# Altium schematic sheet LoadCellAmplifier.SchDoc
size A3; SheetNumber: 1; SheetTotal: 1
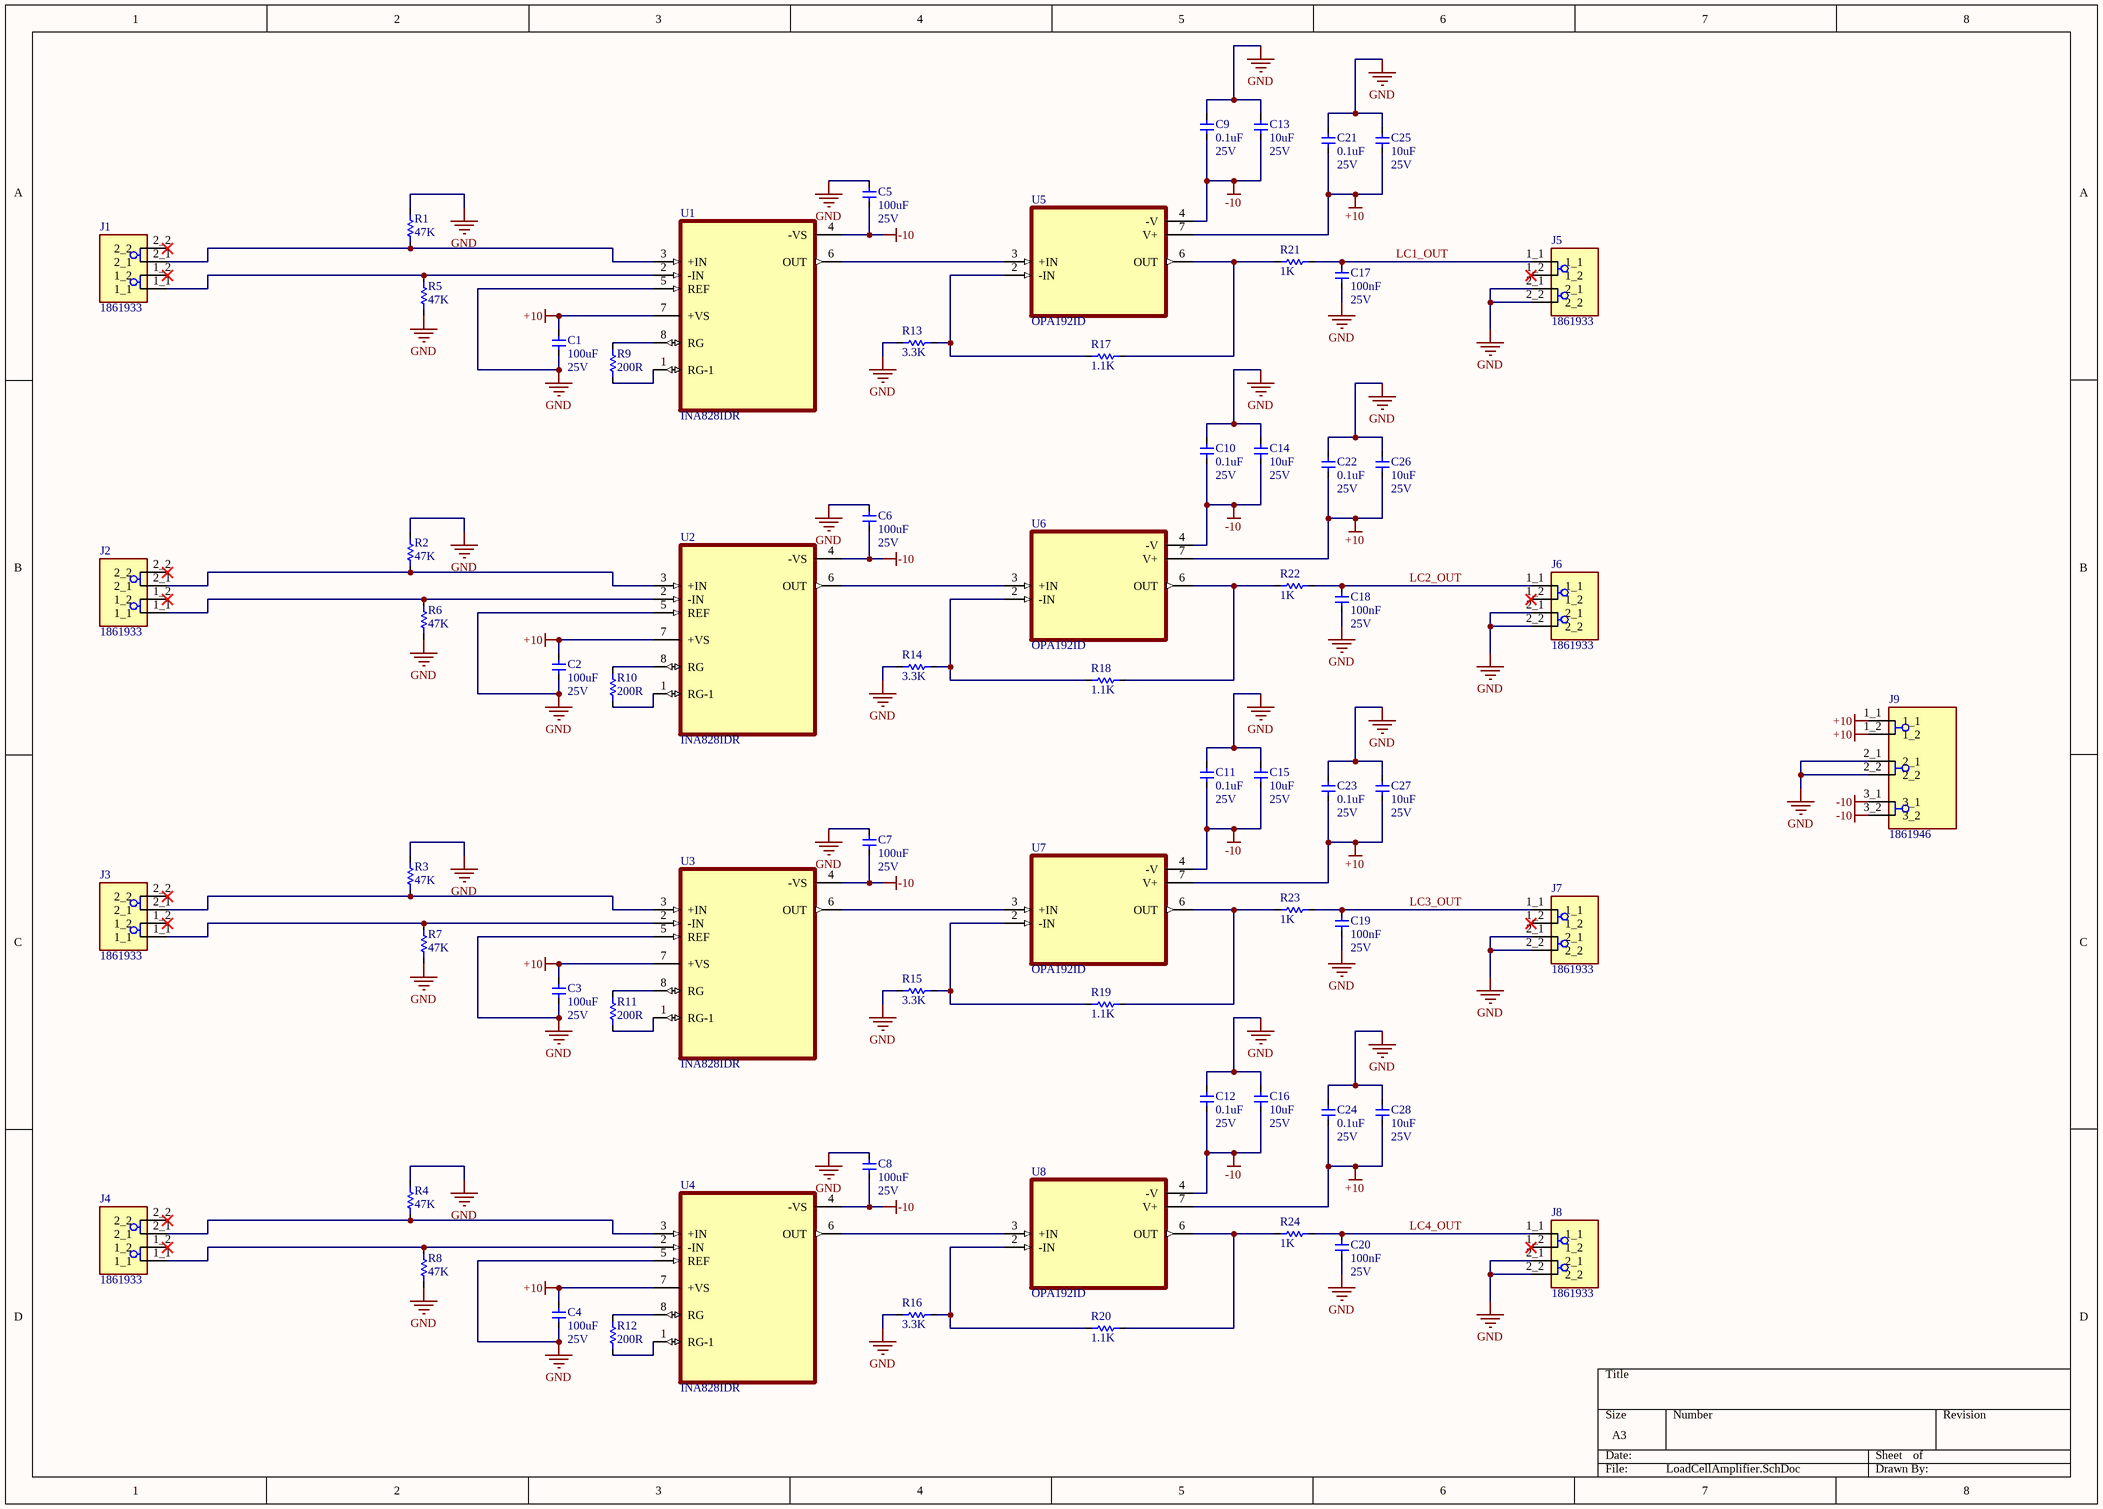
[diagram p0: LoadCellAmplifier.SchDoc]

## Parts
C1  Capacitance: 100uF  Voltage - Rated: 25V  [0603]  (hidden comment: CGA3E2X7R1E104K080AA)
C2  Capacitance: 100uF  Voltage - Rated: 25V  [0603]  (hidden comment: CGA3E2X7R1E104K080AA)
C3  Capacitance: 100uF  Voltage - Rated: 25V  [0603]  (hidden comment: CGA3E2X7R1E104K080AA)
C4  Capacitance: 100uF  Voltage - Rated: 25V  [0603]  (hidden comment: CGA3E2X7R1E104K080AA)
C5  Capacitance: 100uF  Voltage - Rated: 25V  [0603]  (hidden comment: CGA3E2X7R1E104K080AA)
C6  Capacitance: 100uF  Voltage - Rated: 25V  [0603]  (hidden comment: CGA3E2X7R1E104K080AA)
C7  Capacitance: 100uF  Voltage - Rated: 25V  [0603]  (hidden comment: CGA3E2X7R1E104K080AA)
C8  Capacitance: 100uF  Voltage - Rated: 25V  [0603]  (hidden comment: CGA3E2X7R1E104K080AA)
C9  Capacitance: 0.1uF  Voltage - Rated: 25V  [0603]  (hidden comment: CGA3E2X7R1E104K080AA)
C10  Capacitance: 0.1uF  Voltage - Rated: 25V  [0603]  (hidden comment: CGA3E2X7R1E104K080AA)
C11  Capacitance: 0.1uF  Voltage - Rated: 25V  [0603]  (hidden comment: CGA3E2X7R1E104K080AA)
C12  Capacitance: 0.1uF  Voltage - Rated: 25V  [0603]  (hidden comment: CGA3E2X7R1E104K080AA)
C13  Capacitance: 10uF  Voltage - Rated: 25V  [0603]  (hidden comment: CGA3E2X7R1E104K080AA)
C14  Capacitance: 10uF  Voltage - Rated: 25V  [0603]  (hidden comment: CGA3E2X7R1E104K080AA)
C15  Capacitance: 10uF  Voltage - Rated: 25V  [0603]  (hidden comment: CGA3E2X7R1E104K080AA)
C16  Capacitance: 10uF  Voltage - Rated: 25V  [0603]  (hidden comment: CGA3E2X7R1E104K080AA)
C17  Capacitance: 100nF  Voltage - Rated: 25V  [0603]  (hidden comment: CGA3E2X7R1E104K080AA)
C18  Capacitance: 100nF  Voltage - Rated: 25V  [0603]  (hidden comment: CGA3E2X7R1E104K080AA)
C19  Capacitance: 100nF  Voltage - Rated: 25V  [0603]  (hidden comment: CGA3E2X7R1E104K080AA)
C20  Capacitance: 100nF  Voltage - Rated: 25V  [0603]  (hidden comment: CGA3E2X7R1E104K080AA)
C21  Capacitance: 0.1uF  Voltage - Rated: 25V  [0603]  (hidden comment: CGA3E2X7R1E104K080AA)
C22  Capacitance: 0.1uF  Voltage - Rated: 25V  [0603]  (hidden comment: CGA3E2X7R1E104K080AA)
C23  Capacitance: 0.1uF  Voltage - Rated: 25V  [0603]  (hidden comment: CGA3E2X7R1E104K080AA)
C24  Capacitance: 0.1uF  Voltage - Rated: 25V  [0603]  (hidden comment: CGA3E2X7R1E104K080AA)
C25  Capacitance: 10uF  Voltage - Rated: 25V  [0603]  (hidden comment: CGA3E2X7R1E104K080AA)
C26  Capacitance: 10uF  Voltage - Rated: 25V  [0603]  (hidden comment: CGA3E2X7R1E104K080AA)
C27  Capacitance: 10uF  Voltage - Rated: 25V  [0603]  (hidden comment: CGA3E2X7R1E104K080AA)
C28  Capacitance: 10uF  Voltage - Rated: 25V  [0603]  (hidden comment: CGA3E2X7R1E104K080AA)
J1  1861933  [PHOENIX_1861933]
J2  1861933  [PHOENIX_1861933]
J3  1861933  [PHOENIX_1861933]
J4  1861933  [PHOENIX_1861933]
J5  1861933  [PHOENIX_1861933]
J6  1861933  [PHOENIX_1861933]
J7  1861933  [PHOENIX_1861933]
J8  1861933  [PHOENIX_1861933]
J9  1861946  [PHOENIX_1861946]
R1  Resistance: 47K  [0603]  (hidden comment: ERJ-3GEYJ103V)
R2  Resistance: 47K  [0603]  (hidden comment: ERJ-3GEYJ103V)
R3  Resistance: 47K  [0603]  (hidden comment: ERJ-3GEYJ103V)
R4  Resistance: 47K  [0603]  (hidden comment: ERJ-3GEYJ103V)
R5  Resistance: 47K  [0603]  (hidden comment: ERJ-3GEYJ103V)
R6  Resistance: 47K  [0603]  (hidden comment: ERJ-3GEYJ103V)
R7  Resistance: 47K  [0603]  (hidden comment: ERJ-3GEYJ103V)
R8  Resistance: 47K  [0603]  (hidden comment: ERJ-3GEYJ103V)
R9  Resistance: 200R  [0603]  (hidden comment: ERJ-3GEYJ103V)
R10  Resistance: 200R  [0603]  (hidden comment: ERJ-3GEYJ103V)
R11  Resistance: 200R  [0603]  (hidden comment: ERJ-3GEYJ103V)
R12  Resistance: 200R  [0603]  (hidden comment: ERJ-3GEYJ103V)
R13  Resistance: 3.3K  [0603]  (hidden comment: ERJ-3GEYJ103V)
R14  Resistance: 3.3K  [0603]  (hidden comment: ERJ-3GEYJ103V)
R15  Resistance: 3.3K  [0603]  (hidden comment: ERJ-3GEYJ103V)
R16  Resistance: 3.3K  [0603]  (hidden comment: ERJ-3GEYJ103V)
R17  Resistance: 1.1K  [0603]  (hidden comment: ERJ-3GEYJ103V)
R18  Resistance: 1.1K  [0603]  (hidden comment: ERJ-3GEYJ103V)
R19  Resistance: 1.1K  [0603]  (hidden comment: ERJ-3GEYJ103V)
R20  Resistance: 1.1K  [0603]  (hidden comment: ERJ-3GEYJ103V)
R21  Resistance: 1K  [0603]  (hidden comment: ERJ-3GEYJ103V)
R22  Resistance: 1K  [0603]  (hidden comment: ERJ-3GEYJ103V)
R23  Resistance: 1K  [0603]  (hidden comment: ERJ-3GEYJ103V)
R24  Resistance: 1K  [0603]  (hidden comment: ERJ-3GEYJ103V)
U1  INA828IDR  [SOIC127P599X175-8N]
U2  INA828IDR  [SOIC127P599X175-8N]
U3  INA828IDR  [SOIC127P599X175-8N]
U4  INA828IDR  [SOIC127P599X175-8N]
U5  OPA192ID  [SOIC127P599X175-8N]
U6  OPA192ID  [SOIC127P599X175-8N]
U7  OPA192ID  [SOIC127P599X175-8N]
U8  OPA192ID  [SOIC127P599X175-8N]

## Nets
+10: C1.1 C2.1 C3.1 C4.1 C21.2 C22.2 C23.2 C24.2 C25.2 C26.2 C27.2 C28.2 J9.1_1 J9.1_2 U1.7(+VS) U2.7(+VS) U3.7(+VS) U4.7(+VS) U5.7(V+) U6.7(V+) U7.7(V+) U8.7(V+)
-10: C5.2 C6.2 C7.2 C8.2 C9.2 C10.2 C11.2 C12.2 C13.2 C14.2 C15.2 C16.2 J9.3_1 J9.3_2 U1.4(-VS) U2.4(-VS) U3.4(-VS) U4.4(-VS) U5.4(-V) U6.4(-V) U7.4(-V) U8.4(-V)
GND: C1.2 C2.2 C3.2 C4.2 C5.1 C6.1 C7.1 C8.1 C9.1 C10.1 C11.1 C12.1 C13.1 C14.1 C15.1 C16.1 C17.2 C18.2 C19.2 C20.2 C21.1 C22.1 C23.1 C24.1 C25.1 C26.1 C27.1 C28.1 J5.2_1 J5.2_2 J6.2_1 J6.2_2 J7.2_1 J7.2_2 J8.2_1 J8.2_2 J9.2_1 J9.2_2 R1.1 R2.1 R3.1 R4.1 R5.2 R6.2 R7.2 R8.2 R13.1 R14.1 R15.1 R16.1 U1.5(REF) U2.5(REF) U3.5(REF) U4.5(REF)
LC1_OUT: C17.1 J5.1_1 R21.1
LC2_OUT: C18.1 J6.1_1 R22.1
LC3_OUT: C19.1 J7.1_1 R23.1
LC4_OUT: C20.1 J8.1_1 R24.1
NetJ1_1_1: J1.1_1 R5.1 U1.2(-IN)
NetJ1_2_1: J1.2_1 R1.2 U1.3(+IN)
NetJ2_1_1: J2.1_1 R6.1 U2.2(-IN)
NetJ2_2_1: J2.2_1 R2.2 U2.3(+IN)
NetJ3_1_1: J3.1_1 R7.1 U3.2(-IN)
NetJ3_2_1: J3.2_1 R3.2 U3.3(+IN)
NetJ4_1_1: J4.1_1 R8.1 U4.2(-IN)
NetJ4_2_1: J4.2_1 R4.2 U4.3(+IN)
NetR9_1: R9.1 U1.1(RG-1)
NetR9_2: R9.2 U1.8(RG)
NetR10_1: R10.1 U2.1(RG-1)
NetR10_2: R10.2 U2.8(RG)
NetR11_1: R11.1 U3.1(RG-1)
NetR11_2: R11.2 U3.8(RG)
NetR12_1: R12.1 U4.1(RG-1)
NetR12_2: R12.2 U4.8(RG)
NetR13_2: R13.2 R17.2 U5.2(-IN)
NetR14_2: R14.2 R18.2 U6.2(-IN)
NetR15_2: R15.2 R19.2 U7.2(-IN)
NetR16_2: R16.2 R20.2 U8.2(-IN)
NetR17_1: R17.1 R21.2 U5.6(OUT)
NetR18_1: R18.1 R22.2 U6.6(OUT)
NetR19_1: R19.1 R23.2 U7.6(OUT)
NetR20_1: R20.1 R24.2 U8.6(OUT)
NetU1_6: U1.6(OUT) U5.3(+IN)
NetU2_6: U2.6(OUT) U6.3(+IN)
NetU3_6: U3.6(OUT) U7.3(+IN)
NetU4_6: U4.6(OUT) U8.3(+IN)

Not connected (* = marked no-connect by the designer): J1 1_2* 2_2*; J2 1_2* 2_2*; J3 1_2* 2_2*; J4 1_2* 2_2*; J5 1_2*; J6 1_2*; J7 1_2*; J8 1_2*

## Library data of the parts
C1-C28 = CGA3E2X7R1E104K080AA: CAP CER 0.1UF 25V X7R 0603; Manufacturer: TDK Corporation; Tolerance: ±10%; Temperature Coefficient: X7R; Operating Temperature: -55°C ~ 125°C; Mounting Type: Surface Mount, MLCC; Package / Case: 0603 (1608 Metric); Size / Dimension: 0.063" L x 0.031" W (1.60mm x 0.80mm); Manufacturer Part Number: CGA3E2X7R1E104K080AA; Thickness (Max): 0.035" (0.90mm); ComponentLink1Description: Datasheet; ComponentLink1URL: https://product.tdk.com/info/en/catalog/spec/mlccspec_automotive_general_en.pdf; Supplier 1: Digi-Key; Supplier Part Number 1: 445-5667-1-ND
J9 = 1861946: MF: {'manufacturer': u'Phoenix Contact'}; Package: None; Price: None; Value: *; MP: 1861946; Availability: Unavailable
R1-R24 = ERJ-3GEYJ103V: SMD Chip Resistor, 10 kOhm, ï¿½ 5%, 100 mW, 0603 [1608 Metric], Thick Film, General Purpose; Manufacturer: Panasonic Electronic Components; Power  (W): 0.1W; Temperature Coefficient: ±200ppm/°C; Package: 0603 (1608 Metric); Tolerance: ±5%; Operating Temperature: -55°C ~ 155°C; Composition: Thick Film; Manufacturer Part Number: ERJ-3GEYJ103V; ComponentLink1Description: Datasheet; ComponentLink1URL: https://industrial.panasonic.com/cdbs/www-data/pdf/RDA0000/DMA0000COL11.pdf; Supplier 1: Digi-Key; Supplier Part Number 1: P10KGCT-ND; ComponentLink2Description: Land Pattern; ComponentLink2URL: https://industrial.panasonic.com/cdbs/www-data/pdf/RDA0000/DMA0000COL17.pdf
U1-U4 = INA828IDR: 50-Î¼V Offset, 7-nV/âˆšHz Noise, Low-Power, Precision Instrumentation Amplifier; MF: Texas Instruments; SnapEDA_Link: https://www.snapeda.com/parts/INA828IDR/Texas+Instruments/view-part/?ref=snap; Package: SOIC-8 Texas Instruments; Value: *; MP: INA828IDR; Check_prices: https://www.snapeda.com/parts/INA828IDR/Texas+Instruments/view-part/?ref=eda
U5-U8 = OPA192ID: High-Voltage, Rail-to-Rail Input/Output, 5ÂµV, 0.2ÂµV/ËšC, Precision Operational Amplifier; MF: Texas Instruments; SnapEDA_Link: https://www.snapeda.com/parts/OPA192ID/Texas+Instruments/view-part/?ref=snap; Package: SOIC-8 Texas Instruments; Value: *; MP: OPA192ID; Check_prices: https://www.snapeda.com/parts/OPA192ID/Texas+Instruments/view-part/?ref=eda
J1-J8 = 1861933: Package: None; Price: None; Value: *; MP: 1861933; Availability: Unavailable